# Altium schematic sheet real_watch_1v1_displayboard.SchDoc
size A
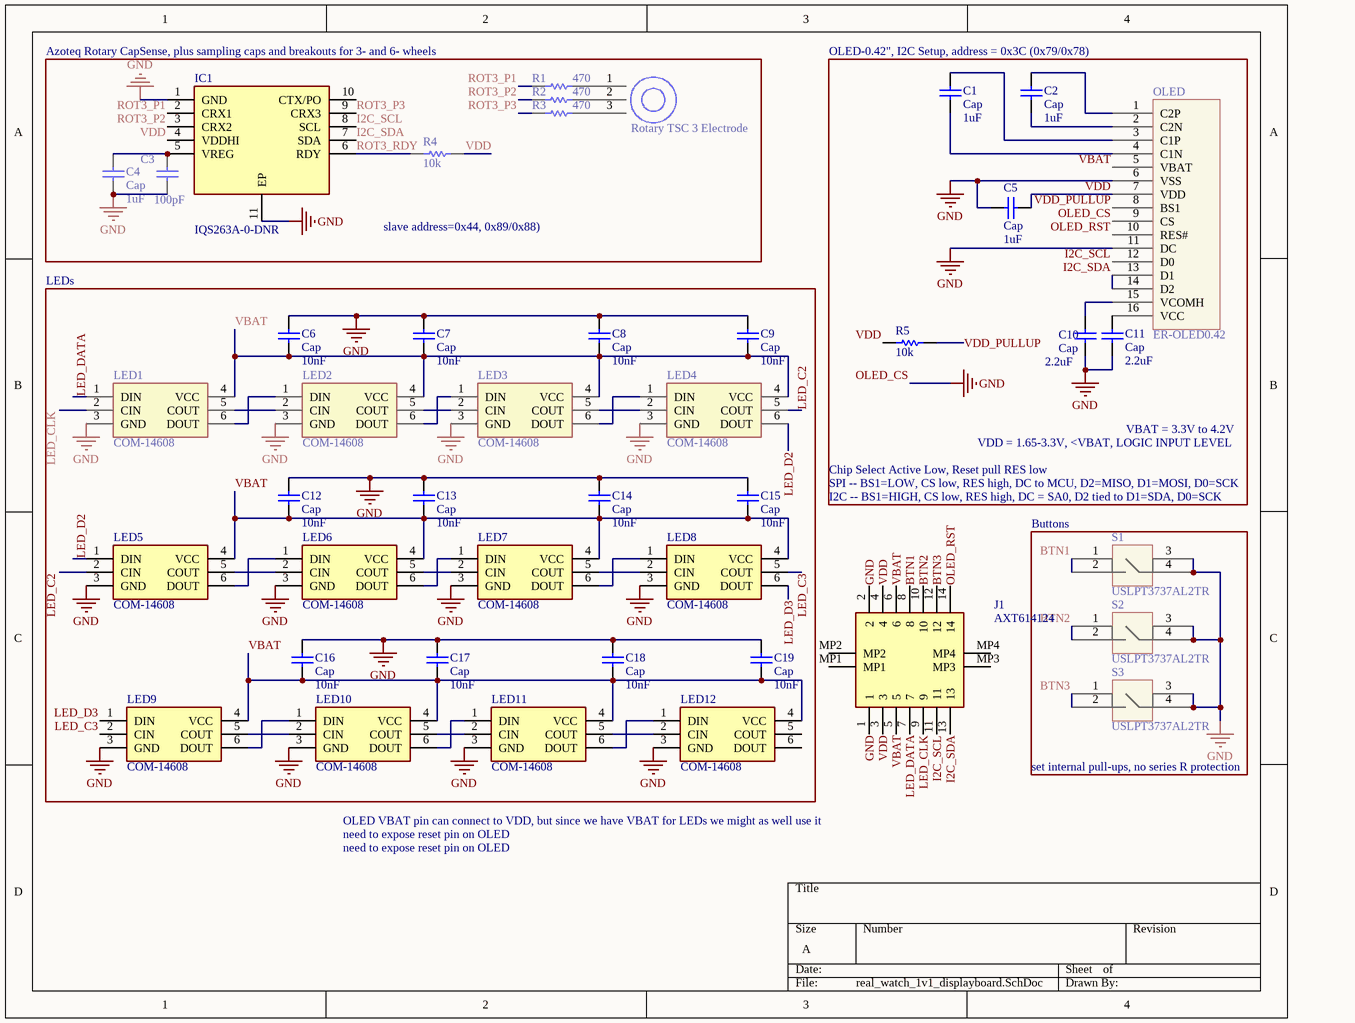
[diagram p0: real_watch_1v1_displayboard.SchDoc]

## Parts
C1  Cap  value 1uF  [0402C]
C2  Cap  value 1uF  [0402C]
C3  value 100pF  [0402C]  (hidden comment: Cap)
C4  Cap  value 1uF  [0402C]
C5  Cap  value 1uF  [0402C]
C6  Cap  value 10nF  [0402C]
C7  Cap  value 10nF  [0402C]
C8  Cap  value 10nF  [0402C]
C9  Cap  value 10nF  [0402C]
C10  Cap  value 2.2uF  [0402C]
C11  Cap  value 2.2uF  [0402C]
C12  Cap  value 10nF  [0402C]
C13  Cap  value 10nF  [0402C]
C14  Cap  value 10nF  [0402C]
C15  Cap  value 10nF  [0402C]
C16  Cap  value 10nF  [0402C]
C17  Cap  value 10nF  [0402C]
C18  Cap  value 10nF  [0402C]
C19  Cap  value 10nF  [0402C]
IC1  IQS263A-0-DNR  [SON50P300X300X80-11N-D]
J1  AXT614124  [AXT614124]
LED1  COM-14608  [SON75P200X200X100-6N]
LED2  COM-14608  [SON75P200X200X100-6N]
LED3  COM-14608  [SON75P200X200X100-6N]
LED4  COM-14608  [SON75P200X200X100-6N]
LED5  COM-14608  [SON75P200X200X100-6N]
LED6  COM-14608  [SON75P200X200X100-6N]
LED7  COM-14608  [SON75P200X200X100-6N]
LED8  COM-14608  [SON75P200X200X100-6N]
LED9  COM-14608  [SON75P200X200X100-6N]
LED10  COM-14608  [SON75P200X200X100-6N]
LED11  COM-14608  [SON75P200X200X100-6N]
LED12  COM-14608  [SON75P200X200X100-6N]
OLED  ER-OLED0.42  [ER-OLED-0.42]
R1  470  [0402R]
R2  470  [0402R]
R3  470  [0402R]
R4  10k  [0402R]
R5  10k  [0402R]
ROT1  Rotary TSC 3 Electrode  [rotary_touch 3 electrode]
S1  USLPT3737AL2TR  [USLPT3737]
S2  USLPT3737AL2TR  [USLPT3737]
S3  USLPT3737AL2TR  [USLPT3737]

## Blocks framed on the sheet
slave address=0x44, 0x89/0x88): C3 C4 IC1 R1-R4 ROT1
LEDs: C6-C9 C12-C19 LED1-LED12

## Nets
GND: C3.1 C4.1 C5.1 C6.2 C7.2 C8.2 C9.2 C10.1 C11.1 C12.2 C13.2 C14.2 C15.2 C16.2 C17.2 C18.2 C19.2 IC1.1(GND) IC1.11(EP) J1.1 J1.2 LED1.3(GND) LED2.3(GND) LED3.3(GND) LED4.3(GND) LED5.3(GND) LED6.3(GND) LED7.3(GND) LED8.3(GND) LED9.3(GND) LED10.3(GND) LED11.3(GND) LED12.3(GND) OLED.6(VSS) OLED.9(CS) OLED.11(DC) S1.3(R) S1.4(R) S2.3(R) S2.4(R) S3.3(R) S3.4(R)  [also labelled OLED_CS]
BTN1: J1.8 S1.1(L) S1.2(L)
BTN2: J1.10 S2.1(L) S2.2(L)
BTN3: J1.12 S3.1(L) S3.2(L)
I2C_SCL: IC1.8(SCL) J1.11 OLED.12(D0)
I2C_SDA: IC1.7(SDA) J1.13 OLED.13(D1) OLED.14(D2)
LED_C2: LED4.5(COUT) LED5.2(CIN)
LED_C3: LED8.5(COUT) LED9.2(CIN)
LED_CLK: J1.9 LED1.2(CIN)
LED_D2: LED4.6(DOUT) LED5.1(DIN)
LED_D3: LED8.6(DOUT) LED9.1(DIN)
LED_DATA: J1.7 LED1.1(DIN)
OLED_RST: J1.14 OLED.10(RES#)
ROT3_P1: IC1.2(CRX1) R1.2
ROT3_P2: IC1.3(CRX2) R2.2
ROT3_P3: IC1.9(CRX3) R3.2
ROT3_RDY: IC1.6(RDY) R4.1
VBAT: C6.1 C7.1 C8.1 C9.1 C12.1 C13.1 C14.1 C15.1 C16.1 C17.1 C18.1 C19.1 J1.5 J1.6 LED1.4(VCC) LED2.4(VCC) LED3.4(VCC) LED4.4(VCC) LED5.4(VCC) LED6.4(VCC) LED7.4(VCC) LED8.4(VCC) LED9.4(VCC) LED10.4(VCC) LED11.4(VCC) LED12.4(VCC) OLED.5(VBAT)
VDD: C5.2 IC1.4(VDDHI) J1.3 J1.4 OLED.7(VDD) R4.2 R5.1
VDD_PULLUP: OLED.8(BS1) R5.2
NetC1_1: C1.1 OLED.4(C1N)
NetC1_2: C1.2 OLED.3(C1P)
NetC2_1: C2.1 OLED.2(C2N)
NetC2_2: C2.2 OLED.1(C2P)
NetC3_2: C3.2 C4.2 IC1.5(VREG)
NetC10_2: C10.2 OLED.15(VCOMH)
NetC11_2: C11.2 OLED.16(VCC)
NetLED1_5: LED1.5(COUT) LED2.2(CIN)
NetLED1_6: LED1.6(DOUT) LED2.1(DIN)
NetLED2_5: LED2.5(COUT) LED3.2(CIN)
NetLED2_6: LED2.6(DOUT) LED3.1(DIN)
NetLED3_5: LED3.5(COUT) LED4.2(CIN)
NetLED3_6: LED3.6(DOUT) LED4.1(DIN)
NetLED5_5: LED5.5(COUT) LED6.2(CIN)
NetLED5_6: LED5.6(DOUT) LED6.1(DIN)
NetLED6_5: LED6.5(COUT) LED7.2(CIN)
NetLED6_6: LED6.6(DOUT) LED7.1(DIN)
NetLED7_5: LED7.5(COUT) LED8.2(CIN)
NetLED7_6: LED7.6(DOUT) LED8.1(DIN)
NetLED9_5: LED9.5(COUT) LED10.2(CIN)
NetLED9_6: LED9.6(DOUT) LED10.1(DIN)
NetLED10_5: LED10.5(COUT) LED11.2(CIN)
NetLED10_6: LED10.6(DOUT) LED11.1(DIN)
NetLED11_5: LED11.5(COUT) LED12.2(CIN)
NetLED11_6: LED11.6(DOUT) LED12.1(DIN)
NetR1_1: R1.1 ROT1.1(e1)
NetR2_1: R2.1 ROT1.2(e2)
NetR3_1: R3.1 ROT1.3(e3)

Not connected (* = marked no-connect by the designer): IC1 10(CTX/PO); J1 MP1 MP2 MP3 MP4; LED12 5(COUT) 6(DOUT)

## Notes on the sheet
- Azoteq Rotary CapSense, plus sampling caps and breakouts for 3- and 6- wheels
- OLED-0.42", I2C Setup, address = 0x3C (0x79/0x78)
- VBAT = 3.3V to 4.2V
- Chip Select Active Low, Reset pull RES low
- SPI -- BS1=LOW, CS low, RES high, DC to MCU, D2=MISO, D1=MOSI, D0=SCK
- I2C -- BS1=HIGH, CS low, RES high, DC = SA0, D2 tied to D1=SDA, D0=SCK
- VDD = 1.65-3.3V, <VBAT, LOGIC INPUT LEVEL
- (near S1) Buttons
- set internal pull-ups, no series R protection
- OLED VBAT pin can connect to VDD, but since we have VBAT for LEDs we might as well use it
- need to expose reset pin on OLED

## Library data of the parts
C1-C19 = Cap: Capacitor; Published: 8-Jun-2000; LatestRevisionDate: 17-Jul-2002; LatestRevisionNote: Re-released for DXP Platform.; PackageReference: RAD-0.3; Publisher: Altium Limited; PackageDescription: Radial Cap, Thru-Hole; 2 Leads; 0.3 in Pin Spacing
IC1 = IQS263A-0-DNR: Integrated Circuit; Manufacturer_Name: Azoteq (Pty) Ltd; Datasheet Link: https://www.mouser.com/datasheet/2/42/iqs263_datasheet-357247.pdf; Height: 0.8mm; Manufacturer_Part_Number: IQS263A-0-DNR
J1 = AXT614124: Connector; Manufacturer_Name: Panasonic; Datasheet Link: https://componentsearchengine.com/Datasheets/1/AXT614124.pdf; Height: 1.03mm; Manufacturer_Part_Number: AXT614124; Mouser Part Number: 769-AXT614124; Mouser Price/Stock: https://www.mouser.com/Search/Refine.aspx?Keyword=769-AXT614124
LED1-LED12 = COM-14608: LED; Manufacturer_Name: SparkFun; Datasheet Link: https://componentsearchengine.com/Datasheets/1/COM-14608.pdf; Height: 1mm; Manufacturer_Part_Number: COM-14608; Mouser Part Number: 474-COM-14608; Mouser Price/Stock: https://www.mouser.com/Search/Refine.aspx?Keyword=474-COM-14608
OLED = ER-OLED0.42: BuyDisplay.com 0.42" OLED Screen I2C/SPI
R1-R5 = Resistor
S1-S3 = USLPT3737AL2TR: TE 0.35mm low profile switch